# EAGLE schematic badge (EAGLE 7.2.0)
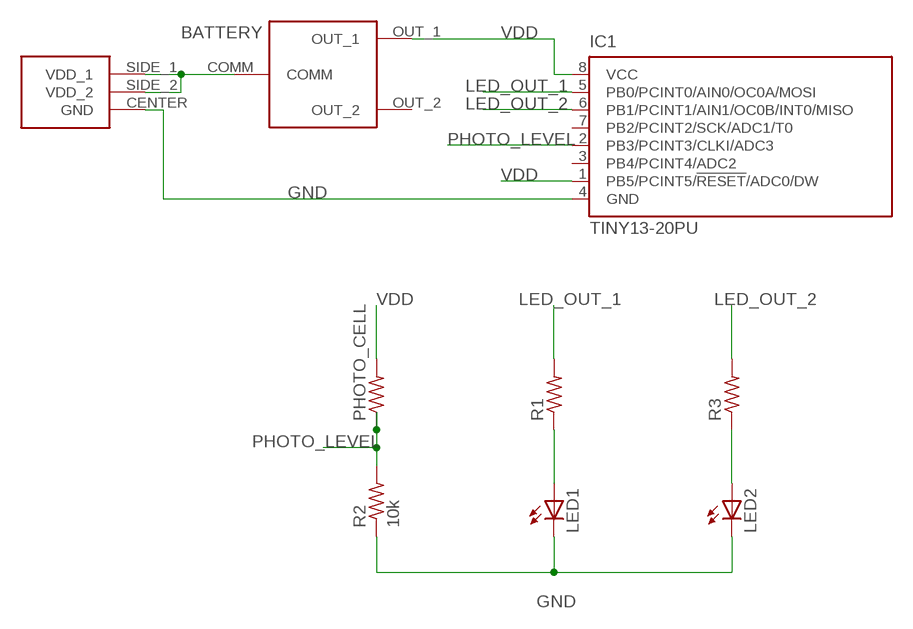
[diagram p0: schematic, sheet 1]

## Parts
IC1  TINY13-20PU  [DIL08]
LED1  LED5MM  [LED5MM]
LED2  LED5MM  [LED5MM]
PHOTO_CELL  R-US_0204/7  [0204/7]
R1  R-US_0204/7  [0204/7]
R2  10k  R-US_0204/7  [0204/7]
R3  R-US_0204/7  [0204/7]
U$1  COIN_CELL_SPARKFUN  [COIN_CELL_SPARKFUN]
U$2  SPST_SPARKFUN  [SPDT_SPARKFUN]

## Nets
BATTERY: U$1.SIDE_1(VDD_1) U$1.SIDE_2(VDD_2) U$2.COMM
GND: IC1.4(GND) LED1.K(C) LED2.K(C) R2.1 U$1.CENTER(GND)
LED_OUT_1: IC1.5(PB0/PCINT0/AIN0/OC0A/MOSI) R1.2
LED_OUT_2: IC1.6(PB1/PCINT1/AIN1/OC0B/INT0/MISO) R3.2
N$2: LED1.A R1.1
N$5: LED2.A R3.1
PHOTO_LEVEL: IC1.2(PB3/PCINT3/CLKI/ADC3) PHOTO_CELL.1 R2.2
VDD: IC1.1(PB5/PCINT5/!RESET!/ADC0/DW) IC1.8(VCC) PHOTO_CELL.2 U$2.OUT_1
Unconnected: IC1.3(PB4/PCINT4/ADC2) IC1.7(PB2/PCINT2/SCK/ADC1/T0) U$2.OUT_2

## Library data of the parts
IC1 = atmel:TINY13: 8-bit AVR Microcontroller with 1K Bytes In-System Programmable Flash Source: http://www.atmel.com/dyn/resources/prod_documents/2535S.pdf; MPN: ATTINY13-20PU; OC_FARNELL: 9171550; OC_NEWARK: 96K6521
LED1 LED2 = led:LED: LED OSRAM: - CHIPLED LG R971, LG N971, LY N971, LG Q971, LY Q971, LO R971, LY R971 LH N974, LH R974 LS Q976, LO Q976, LY Q976 LO Q996 - Hyper CHIPLED LW Q18S LB Q993, LB Q99A, LB R99A - SideLED LS A670, LO A670, LY A670, LG A670, LP A670 LB A673, LV A673, LT A673, LW A673 LH A674 LY A675 LS A676, LA A676, LO A676, LY A676, LW A676 LS A679, LY A679, LG A679 - Hyper Micro SIDELED® LS Y876, LA Y876, LO Y876, LY Y876 LT Y87S - SmartLED LW L88C, LW L88S LB L89C, LB L89S, LG L890 LS L89K, LO L89K, LY L89K LS L896, LA L896, LO L896, LY L896 - TOPLED LS T670, LO T670, LY T670, LG T670, LP T670 LSG T670, LSP T670, LSY T670, LOP T670, LYG T670 LG T671, LOG T671, LSG T671 LB T673, LV T673, LT T673, LW T673 LH T674 LS T676, LA T676, LO T676, LY T676, LB T676, LH T676, LSB T676, LW T676 LB T67C, LV T67C, LT T67C, LS T67K, LO T67K, LY T67K, LW E67C LS E67B, LA E67B, LO E67B, LY E67B, LB E67C, LV E67C, LT E67C LW T67C LS T679, LY T679, LG T679 LS T770, LO T770, LY T770, LG T770, LP T770 LB T773, LV T773, LT T773, LW T773 LH T774 LS E675, LA E675, LY E675, LS T675 LS T776, LA T776, LO T776, LY T776, LB T776 LHGB T686 LT T68C, LB T68C - Hyper Mini TOPLED® LB M676 - Mini TOPLED Santana® LG M470 LS M47K, LO M47K, LY M47K Source: http://www.osram.convergy.de LUXEON: - LUMILED® LXK2-PW12-R00, LXK2-PW12-S00, LXK2-PW14-U00, LXK2-PW14-V00 LXK2-PM12-R00, LXK2-PM12-S00, LXK2-PM14-U00 LXK2-PE12-Q00, LXK2-PE12-R00, LXK2-PE12-S00, LXK2-PE14-T00, LXK2-PE14-U00 LXK2-PB12-K00, LXK2-PB12-L00, LXK2-PB12-M00, LXK2-PB14-N00, LXK2-PB14-P00, LXK2-PB14-Q00 LXK2-PR12-L00, LXK2-PR12-M00, LXK2-PR14-Q00, LXK2-PR14-R00 LXK2-PD12-Q00, LXK2-PD12-R00, LXK2-PD12-S00 LXK2-PH12-R00, LXK2-PH12-S00 LXK2-PL12-P00, LXK2-PL12-Q00, LXK2-PL12-R00 Source: www.luxeon.com KINGBRIGHT: KA-3528ASYC Source: www.kingbright.com
PHOTO_CELL R1-R3 = resistor:R-US_: RESISTOR, American symbol
U$1 = eoh:COIN_CELL_SPARKFUN
U$2 = eoh:SPST_SPARKFUN